# EAGLE schematic prop-driver (EAGLE 6.4)
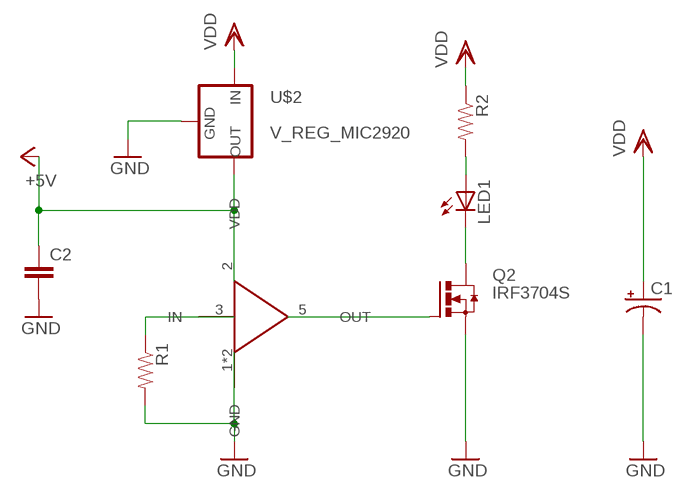
[diagram p0: schematic, sheet 1]

## Parts
C1  CAP_POLD  [PANASONIC_D]
C2  CAP1206  [1206]
LED1  LED-FKIT-1206  [FKIT-LED-1206]
Q2  IRF3704S  [D2PACK]
R1  RESISTOR1206  [1206]
R2  RESISTOR1206  [1206]
U$1  MCP1402  [SOT23-5]
U$2  V_REG_MIC2920  [SOT223]

## Nets
+5V: C2.1 U$1.2(VDD) U$2.3(OUT)
GND: C1.- C2.2 Q2.3(S) R1.2 U$1.1(GND) U$1.4(GND) U$2.2(GND)
N$1: Q2.1(G) U$1.5(OUT)
N$2: R1.1 U$1.3(IN)
N$5: LED1.C Q2.2(D)
N$14: LED1.A R2.2
VDD: C1.+ R2.1 U$2.1(IN)

## Library data of the parts
C1 = SparkFun:CAP_POL: Capacitor Polarized These are standard SMD and PTH capacitors. Normally 10uF, 47uF, and 100uF in electrolytic and tantalum varieties. Always verify the external diameter of the through hole cap, it varies with capacity, voltage, and manufacturer. The EIA devices should be standard.
C2 = SparkFun:CAP: Capacitor Standard 0603 ceramic capacitor, and 0.1" leaded capacitor.
LED1 = SparkFun:LED: LEDs Standard schematic elements and footprints for 5mm, 3mm, 1206, and 0603 sized LEDs. 5mm - Spark Fun Electronics SKU : COM-00529 (and others)
Q2 = transistor-power:IRF3704: SMPS MOSFET HEXFET® Power MOSFET Source: http://www.irf.com/product-info/datasheets/data/irf3704.pdf
R1 R2 = SparkFun:RESISTOR: Resistor Basic schematic elements and footprints for 0603, 1206, and PTH resistors.
U$1 = johndavid400:MCP1402
U$2 = SparkFun:V_REG_MIC2920: MIC2920A (http://www.micrel.com/_PDF/mic2920.pdf) - 400mA output LDO Regulator